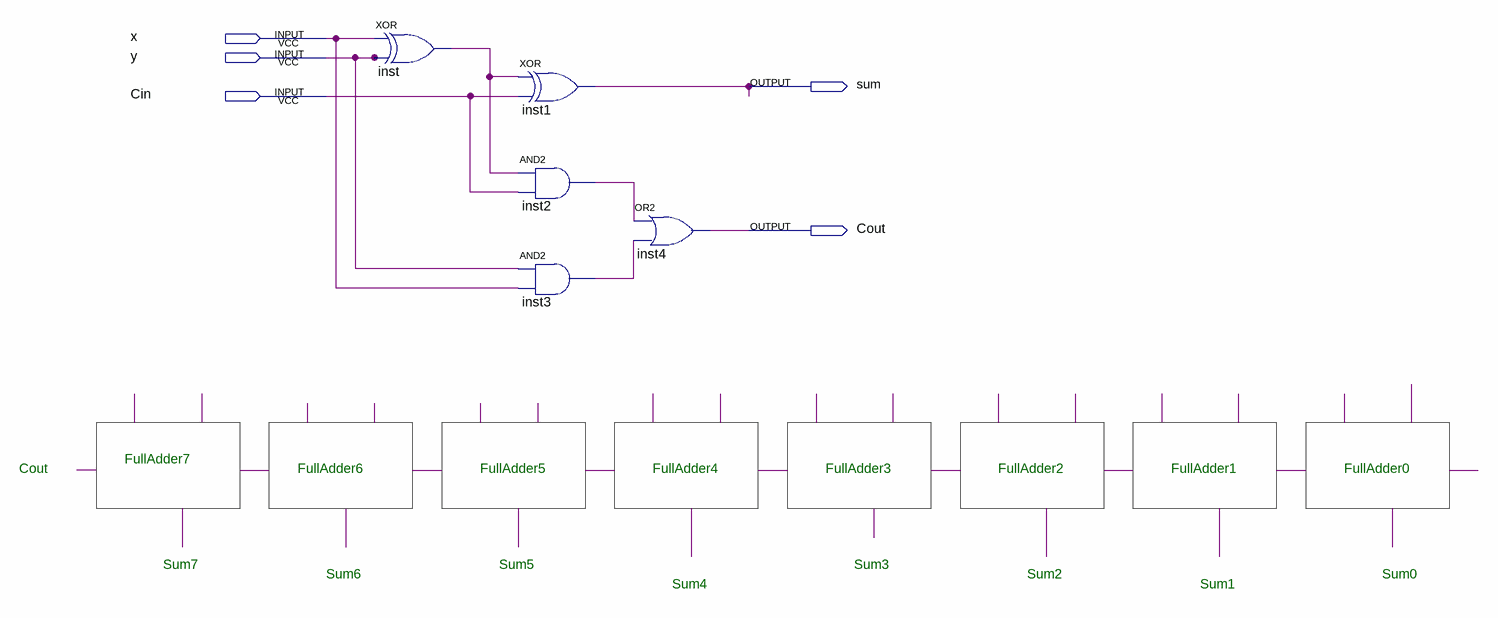
[diagram p0: schematic sheet]
// Quartus schematic FullAdder.bdf as structural Verilog: 5 symbols, 5 pins
module FullAdder (
  input  x,
  input  y,
  input  Cin,
  output sum,
  output Cout
);

  wire inst2_out, inst3_out, inst_out;

  xor inst (inst_out, x, y);
  xor inst1 (sum, inst_out, Cin);
  and inst2 (inst2_out, inst_out, Cin);
  and inst3 (inst3_out, y, x);
  or inst4 (Cout, inst2_out, inst3_out);

  // Notes on the sheet:
  //   FullAdder7
  //   Cout
  //   FullAdder6
  //   FullAdder5
  //   FullAdder4
  //   FullAdder3
  //   FullAdder2
  //   FullAdder1
  //   FullAdder0
  //   Sum7
  //   Sum5
  //   Sum3
  //   Sum6
  //   Sum2
  //   Sum0
  //   Sum4
  //   Sum1
endmodule
